# EAGLE design bipap_mechanical_tester (EAGLE 9.6.2)
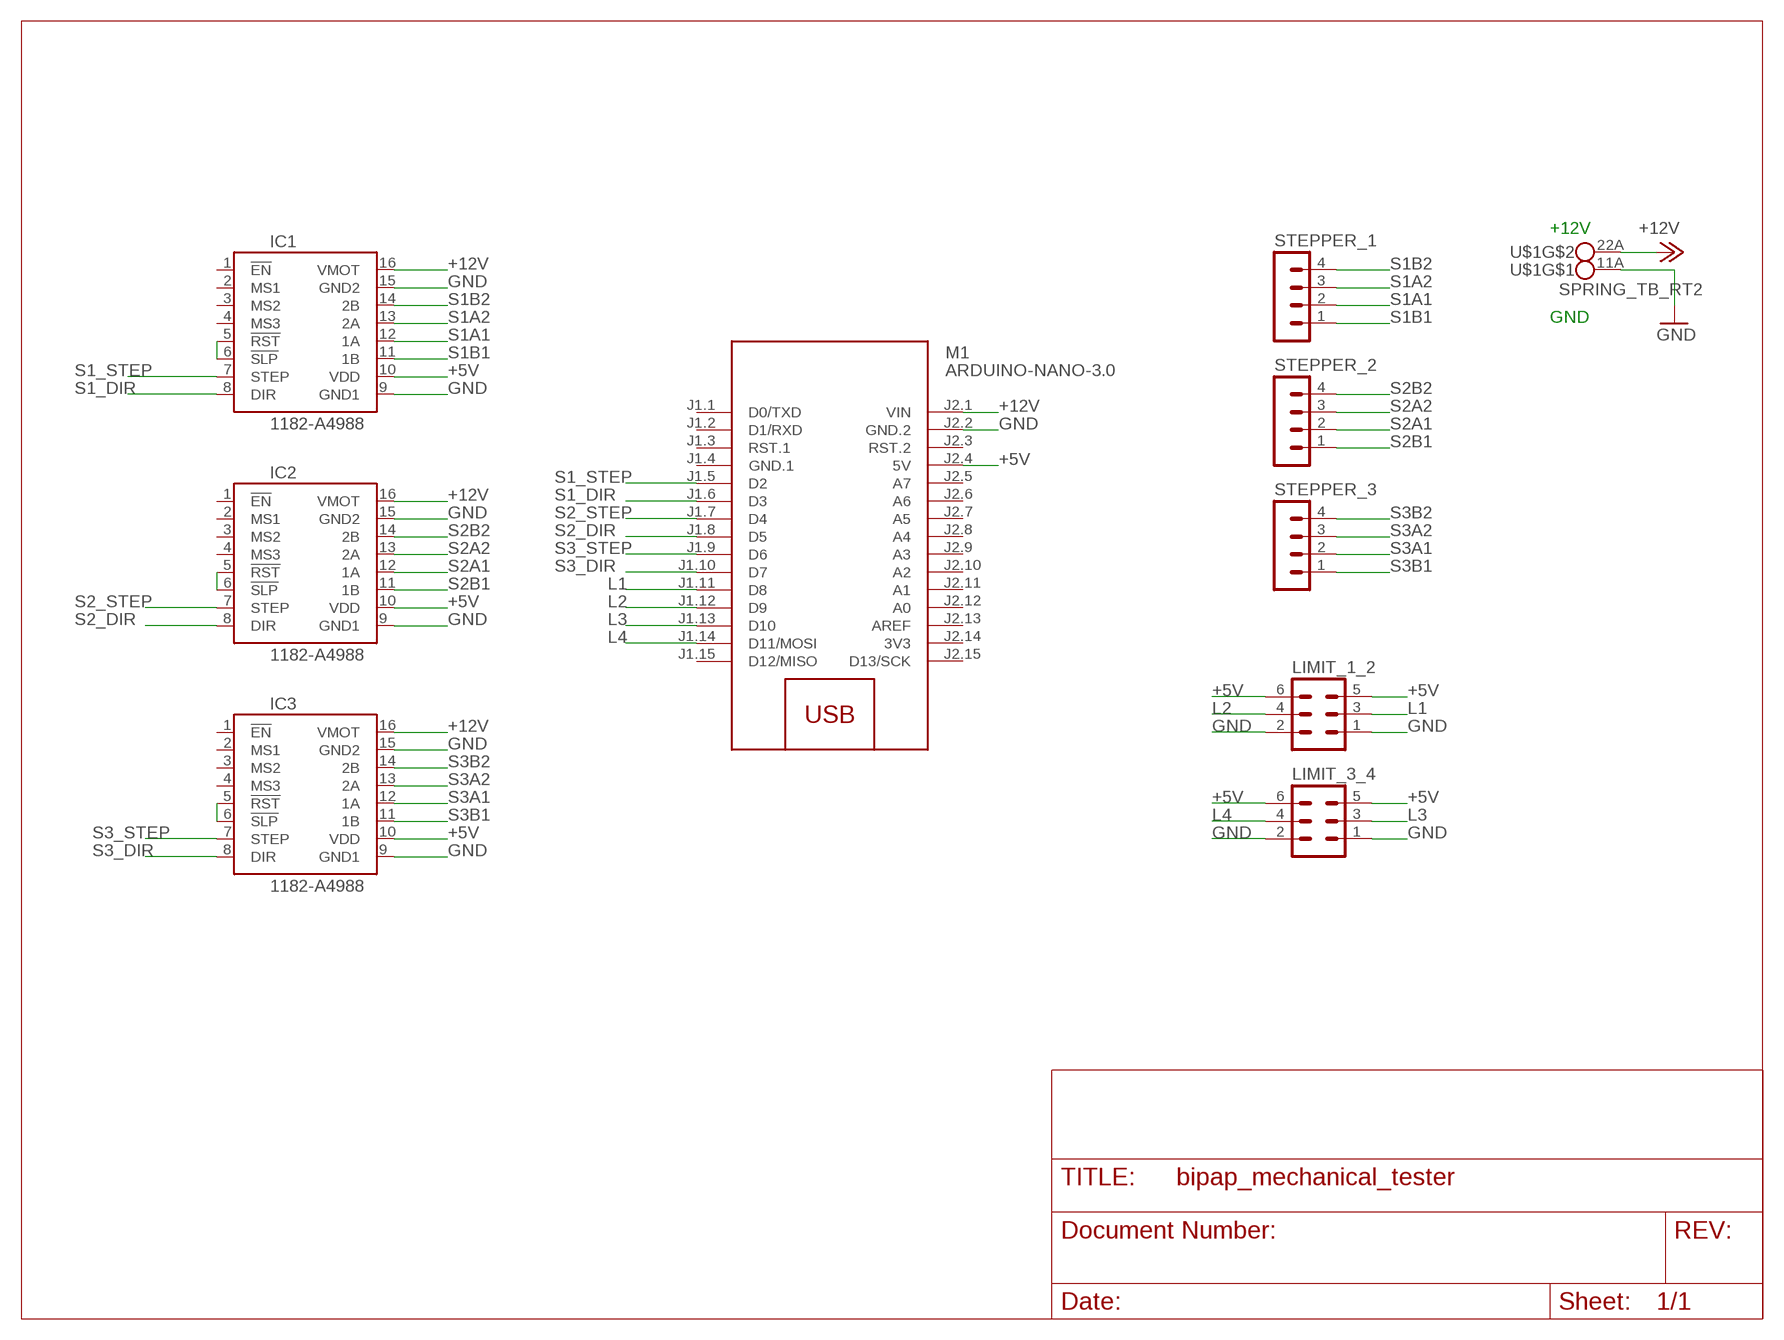
[diagram p0: schematic, sheet 1]

## Parts
IC1  1182-A4988  [A4988]
IC2  1182-A4988  [A4988]
IC3  1182-A4988  [A4988]
LIMIT_1_2  MA03-2  [MA03-2]
LIMIT_3_4  MA03-2  [MA03-2]
M1  ARDUINO-NANO-3.0  [ARDUINO-NANO-3.0]
STEPPER_1  MA04-1  [MA04-1]
STEPPER_2  MA04-1  [MA04-1]
STEPPER_3  MA04-1  [MA04-1]
U$1  SPRING_TB_RT2  [SPRING_TB_RT2]

## Nets
+5V: IC1.10(VDD) IC2.10(VDD) IC3.10(VDD) LIMIT_1_2.5 LIMIT_1_2.6 LIMIT_3_4.5 LIMIT_3_4.6 M1.J2.4(5V)
+12V: IC1.16(VMOT) IC2.16(VMOT) IC3.16(VMOT) M1.J2.1(VIN) U$1.2A
GND: IC1.9(GND1) IC1.15(GND2) IC2.9(GND1) IC2.15(GND2) IC3.9(GND1) IC3.15(GND2) LIMIT_1_2.1 LIMIT_1_2.2 LIMIT_3_4.1 LIMIT_3_4.2 M1.J2.2(GND.2) U$1.1A
L1: LIMIT_1_2.3 M1.J1.11(D8)
L2: LIMIT_1_2.4 M1.J1.12(D9)
L3: LIMIT_3_4.3 M1.J1.13(D10)
L4: LIMIT_3_4.4 M1.J1.14(D11/MOSI)
N$1: IC1.5(!RST) IC1.6(!SLP)
N$2: IC2.5(!RST) IC2.6(!SLP)
N$3: IC3.5(!RST) IC3.6(!SLP)
S1_DIR: IC1.8(DIR) M1.J1.6(D3)
S1_STEP: IC1.7(STEP) M1.J1.5(D2)
S1A1: IC1.12(1A) STEPPER_1.2
S1A2: IC1.13(2A) STEPPER_1.3
S1B1: IC1.11(1B) STEPPER_1.1
S1B2: IC1.14(2B) STEPPER_1.4
S2_DIR: IC2.8(DIR) M1.J1.8(D5)
S2_STEP: IC2.7(STEP) M1.J1.7(D4)
S2A1: IC2.12(1A) STEPPER_2.2
S2A2: IC2.13(2A) STEPPER_2.3
S2B1: IC2.11(1B) STEPPER_2.1
S2B2: IC2.14(2B) STEPPER_2.4
S3_DIR: IC3.8(DIR) M1.J1.10(D7)
S3_STEP: IC3.7(STEP) M1.J1.9(D6)
S3A1: IC3.12(1A) STEPPER_3.2
S3A2: IC3.13(2A) STEPPER_3.3
S3B1: IC3.11(1B) STEPPER_3.1
S3B2: IC3.14(2B) STEPPER_3.4
Unconnected: IC1.1(!EN) IC1.2(MS1) IC1.3(MS2) IC1.4(MS3) IC2.1(!EN) IC2.2(MS1) IC2.3(MS2) IC2.4(MS3) IC3.1(!EN) IC3.2(MS1) IC3.3(MS2) IC3.4(MS3) M1.J1.1(D0/TXD) M1.J1.2(D1/RXD) M1.J1.3(RST.1) M1.J1.15(D12/MISO) M1.J2.3(RST.2) M1.J2.5(A7) M1.J2.6(A6) M1.J2.7(A5) M1.J2.8(A4) M1.J2.9(A3) M1.J2.10(A2) M1.J2.11(A1) M1.J2.12(A0) M1.J2.13(AREF) M1.J2.15(D13/SCK) U$1.1 U$1.2

## Notes on the sheet
- +12V
- GND

## Power pins joined to a net without a drawn wire
3V3: M1.J2.14(3V3)
GND.1: M1.J1.4(GND.1)

## Library data of the parts
IC1-IC3 = pololu-stepper-driver:1182-A4988: A4988 Stepper Motor Driver Carrier #1182 A4988 Stepper Motor Driver Carrier <https://www.pololu.com/product/1182> in Japan, Suzaku Lab. Ltd. <https://suzakugiken.jp/> #1182 A4988ステッピングモータドライバ <https://szc.jp/po1182>
LIMIT_1_2 LIMIT_3_4 = con-lstb:MA03-2: PIN HEADER; OC_FARNELL: unknown; OC_NEWARK: unknown
M1 = diy-modules:ARDUINO-NANO-3.0: Arduino Nano 3.0
STEPPER_1-STEPPER_3 = con-lstb:MA04-1: PIN HEADER; OC_FARNELL: unknown; OC_NEWARK: unknown
U$1 = srg:SPRING_TB_RT2: Spring Loaded Terminal Block 4UCON 0.10 pitch right angle 2 amps 20-26 AWG Adafruit: P/N 1074 <http://www.adafruit.com/products/1074> Terminal block comes with 3 terminals, but the are modular so you can add or remove terminals

## Board
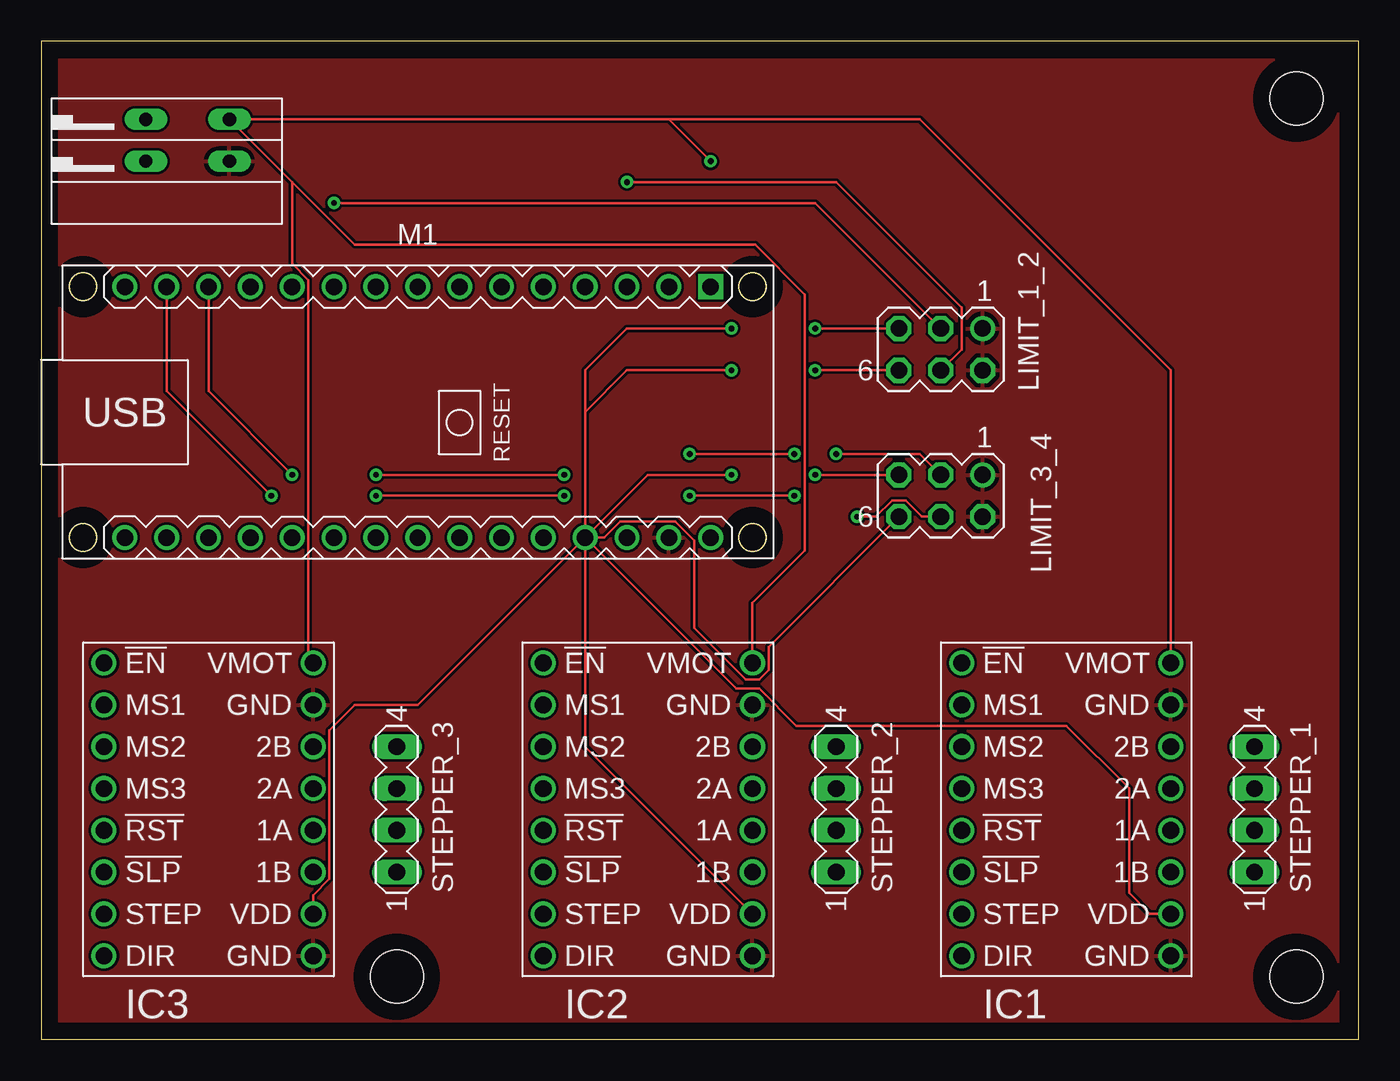
[diagram p1: board, top side]
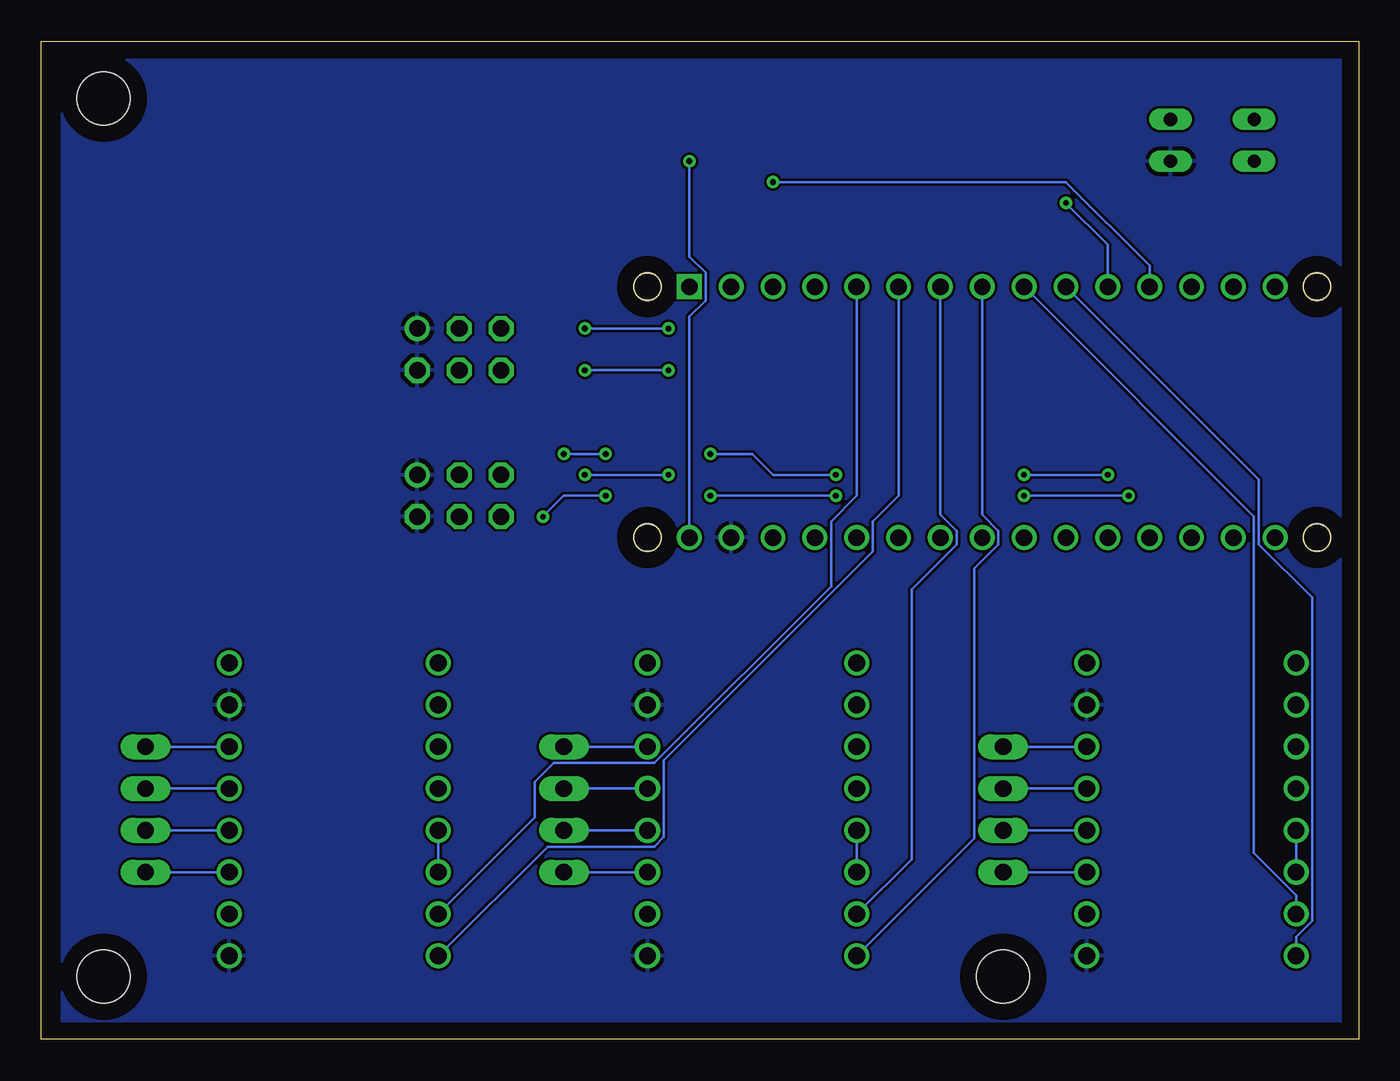
[diagram p2: board, bottom side, seen from below]

Size 79.99 x 60.63 mm. Coordinates in mm from the lower left corner, seen from the top.
Outline: 42.35,30.44 arc174 44.01,30.44 44.01,30.52 arc174 42.35,30.52 42.35,30.44
Outline: 42.35,45.68 arc174 44.01,45.68 44.01,45.76 arc174 42.35,45.76 42.35,45.68
Outline: 1.71,30.44 arc174 3.37,30.44 3.37,30.52 arc174 1.71,30.52 1.71,30.44
Outline: 1.71,45.68 arc174 3.37,45.68 3.37,45.76 arc174 1.71,45.76 1.71,45.68
Outline: 0,60.63 0,0 79.99,0 79.99,60.63 0,60.63
Copper layers (1*16): Top 0.035mm / dielectric 1.5mm / Bottom 0.035mm
Design rules "default": minimum track width 6mil, minimum drill 0.35mm, track to track 6mil, track to pad 6mil, pad to pad 6mil, via to via 6mil, smd to smd 6mil, copper to edge 40mil, drill to drill 6mil, minimum pad ring 10mil, minimum via ring 8mil, stop-mask expansion 4mil, vias tented up to drill 0mil, thermal gap 10mil
Holes 3.2 mm at 76.2,57.15 76.2,3.81 21.59,3.81
Holes 1.65 mm at 2.54,45.72 2.54,30.48 43.18,30.48 43.18,45.72

### Footprints (pad centres in the part's own frame; a part is rotated, then mirrored left to right if it is on the bottom)
A4988 = drill 1.016: 1 -6.35,8.89; 2 -6.35,6.35; 3 -6.35,3.81; 4 -6.35,1.27; 5 -6.35,-1.27; 6 -6.35,-3.81; 7 -6.35,-6.35; 8 -6.35,-8.89; 9 6.35,-8.89; 10 6.35,-6.35; 11 6.35,-3.81; 12 6.35,-1.27; 13 6.35,1.27; 14 6.35,3.81; 15 6.35,6.35; 16 6.35,8.89
MA03-2 = drill 1.016: 1 -2.54,-1.27 | drill 1.016 octagon: 2 -2.54,1.27; 3 0,-1.27; 4 0,1.27; 5 2.54,-1.27; 6 2.54,1.27
ARDUINO-NANO-3.0 = drill 1 square: J1.1 17.78,7.62 | drill 1: J1.2 15.24,7.62; J1.3 12.7,7.62; J1.4 10.16,7.62; J1.5 7.62,7.62; J1.6 5.08,7.62; J1.7 2.54,7.62; J1.8 0,7.62; J1.9 -2.54,7.62; J1.10 -5.08,7.62; J1.11 -7.62,7.62; J1.12 -10.16,7.62; J1.13 -12.7,7.62; J1.14 -15.24,7.62; J1.15 -17.78,7.62; J2.1 17.78,-7.62; J2.2 15.24,-7.62; J2.3 12.7,-7.62; J2.4 10.16,-7.62; J2.5 7.62,-7.62; J2.6 5.08,-7.62; J2.7 2.54,-7.62; J2.8 0,-7.62; J2.9 -2.54,-7.62; J2.10 -5.08,-7.62; J2.11 -7.62,-7.62; J2.12 -10.16,-7.62; J2.13 -12.7,-7.62; J2.14 -15.24,-7.62; J2.15 -17.78,-7.62 | hole 1.651: -20.32,7.62; -20.32,-7.62; 20.32,-7.62; 20.32,7.62
MA04-1 = drill 1.016 long: 1 -3.81,0; 2 -1.27,0; 3 1.27,0; 4 3.81,0
SPRING_TB_RT2 = drill 0.8 long: 1 -1.27,2.54; 1A -1.27,-2.54; 2 1.27,2.54; 2A 1.27,-2.54

### Placement (x,y rotation side)
IC1  62.23,13.97 0 top
IC2  36.83,13.97 0 top
IC3  10.16,13.97 0 top
LIMIT_1_2  54.61,41.91 180 top
LIMIT_3_4  54.61,33.02 180 top
M1  22.86,38.1 0 top
STEPPER_1  73.66,13.97 90 top
STEPPER_2  48.26,13.97 90 top
STEPPER_3  21.59,13.97 90 top
U$1  8.89,54.61 90 top

### Tracks (layer width: path | path; a pad name or v marks a point on that pad's centre or on a via)
+5V  (via drill 0.35)
  Top 0.152: M1.J2.4 34.17,30.48 35.15,31.46 38.51,31.46 39.66,30.31 39.66,24.98 42.77,21.87 43.59,21.87 44.17,22.45 44.17,23.85 LIMIT_3_4.6 | M1.J2.4 36.83,34.29 v41.91,34.29 | v46.99,34.29 LIMIT_3_4.5 | M1.J2.4 33.02,38.1 35.56,40.64 v41.91,40.64 | v46.99,40.64 LIMIT_1_2.6 | M1.J2.4 33.02,40.64 35.56,43.18 v41.91,43.18 | v46.99,43.18 LIMIT_1_2.5 | M1.J2.4 33.02,17.78 IC2.10 | M1.J2.4 22.86,20.32 19.05,20.32 17.5,18.77 17.5,9.75 16.51,8.76 IC3.10 | M1.J2.4 42.19,21.31 43.59,21.31 45.85,19.05 62.23,19.05 66.04,15.24 66.04,8.89 67.31,7.62 IC1.10
  Bottom 0.152: v41.91,40.64 v46.99,40.64 | v41.91,43.18 v46.99,43.18 | v41.91,34.29 v46.99,34.29
+12V  (via drill 0.35)
  Top 0.152: U$1.2A 38.1,55.88 | 38.1,55.88 53.34,55.88 68.58,40.64 IC1.16 | U$1.2A 19.05,48.26 43.35,48.26 46.37,45.24 46.37,29.69 43.18,26.5 IC2.16 | U$1.2A 15.24,52.07 15.24,47.11 16.22,46.13 16.22,23.15 IC3.16 | 38.1,55.88 v40.64,53.34
  Bottom 0.152: M1.J2.1 40.64,43.18 40.64,43.89 39.66,44.87 39.66,46.57 40.64,47.55 v40.64,53.34
GND
  pour Top: 0,0 78.74,59.69 78.74,0
  pour Top: 0,59.69 78.74,59.69 78.74,0 0,0
  pour Bottom: 0,59.69 78.74,59.69 78.74,0 0,0
L1  (via drill 0.35)
  Top 0.152: LIMIT_1_2.3 46.99,50.8 v17.78,50.8
  Bottom 0.152: v17.78,50.8 15.24,48.26 M1.J1.11
L2  (via drill 0.35)
  Top 0.152: LIMIT_1_2.4 55.88,41.91 55.88,44.45 48.26,52.07 v35.56,52.07
  Bottom 0.152: M1.J1.12 12.7,46.99 17.78,52.07 v35.56,52.07
L3  (via drill 0.35)
  Top 0.152: v15.24,34.29 10.16,39.37 M1.J1.13 | v20.32,34.29 v31.75,34.29 | v39.37,35.56 v45.72,35.56 | v48.26,35.56 53.34,35.56 LIMIT_3_4.3
  Bottom 0.152: v15.24,34.29 v20.32,34.29 | v31.75,34.29 35.56,34.29 36.83,35.56 v39.37,35.56 | v45.72,35.56 v48.26,35.56
L4  (via drill 0.35)
  Top 0.152: M1.J1.14 7.62,39.37 v13.97,33.02 | v20.32,33.02 v31.75,33.02 | v39.37,33.02 v45.72,33.02 | v49.53,31.75 50.67,31.75 51.66,32.74 52.48,32.74 53.47,31.75 LIMIT_3_4.4
  Bottom 0.152: v13.97,33.02 v20.32,33.02 | v31.75,33.02 v39.37,33.02 | v45.72,33.02 48.26,33.02 v49.53,31.75
N$1
  Bottom 0.152: IC1.5 IC1.6
N$2
  Bottom 0.152: IC2.5 IC2.6
N$3
  Bottom 0.152: IC3.5 IC3.6
S1_DIR
  Bottom 0.152: M1.J1.6 27.94,33.02 29.5,31.46 29.5,29.63 42.19,16.94 42.19,12.29 42.77,11.71 49.25,11.71 IC1.8
S1_STEP
  Bottom 0.152: M1.J1.5 30.48,33.02 32.04,31.46 32.04,27.52 42.77,16.79 48.87,16.79 50.01,15.65 50.01,13.49 IC1.7
S1A1
  Bottom 0.152: IC1.12 STEPPER_1.2
S1A2
  Bottom 0.152: IC1.13 STEPPER_1.3
S1B1
  Bottom 0.152: IC1.11 STEPPER_1.1
S1B2
  Bottom 0.152: IC1.14 STEPPER_1.4
S2_DIR
  Bottom 0.152: IC2.8 23.34,12.22 23.34,28.61 21.88,30.07 21.88,30.89 22.86,31.87 M1.J1.8
S2_STEP
  Bottom 0.152: IC2.7 27.15,10.95 27.15,27.34 24.42,30.07 24.42,30.89 25.4,31.87 M1.J1.7
S2A1
  Bottom 0.152: IC2.12 STEPPER_2.2
S2A2
  Bottom 0.152: IC2.13 STEPPER_2.3
S2B1
  Bottom 0.152: IC2.11 STEPPER_2.1
S2B2
  Bottom 0.152: IC2.14 STEPPER_2.4
S3_DIR
  Bottom 0.152: IC3.8 3.81,6.22 2.82,7.21 2.82,26.83 6.06,30.07 6.06,34 M1.J1.10
S3_STEP
  Bottom 0.152: M1.J1.9 6.37,31.77 6.37,11.32 3.81,8.76 IC3.7
S3A1
  Bottom 0.152: IC3.12 STEPPER_3.2
S3A2
  Bottom 0.152: IC3.13 STEPPER_3.3
S3B1
  Bottom 0.152: IC3.11 STEPPER_3.1
S3B2
  Bottom 0.152: IC3.14 STEPPER_3.4